# Altium project TestPCB_v1.0.PrjPcb
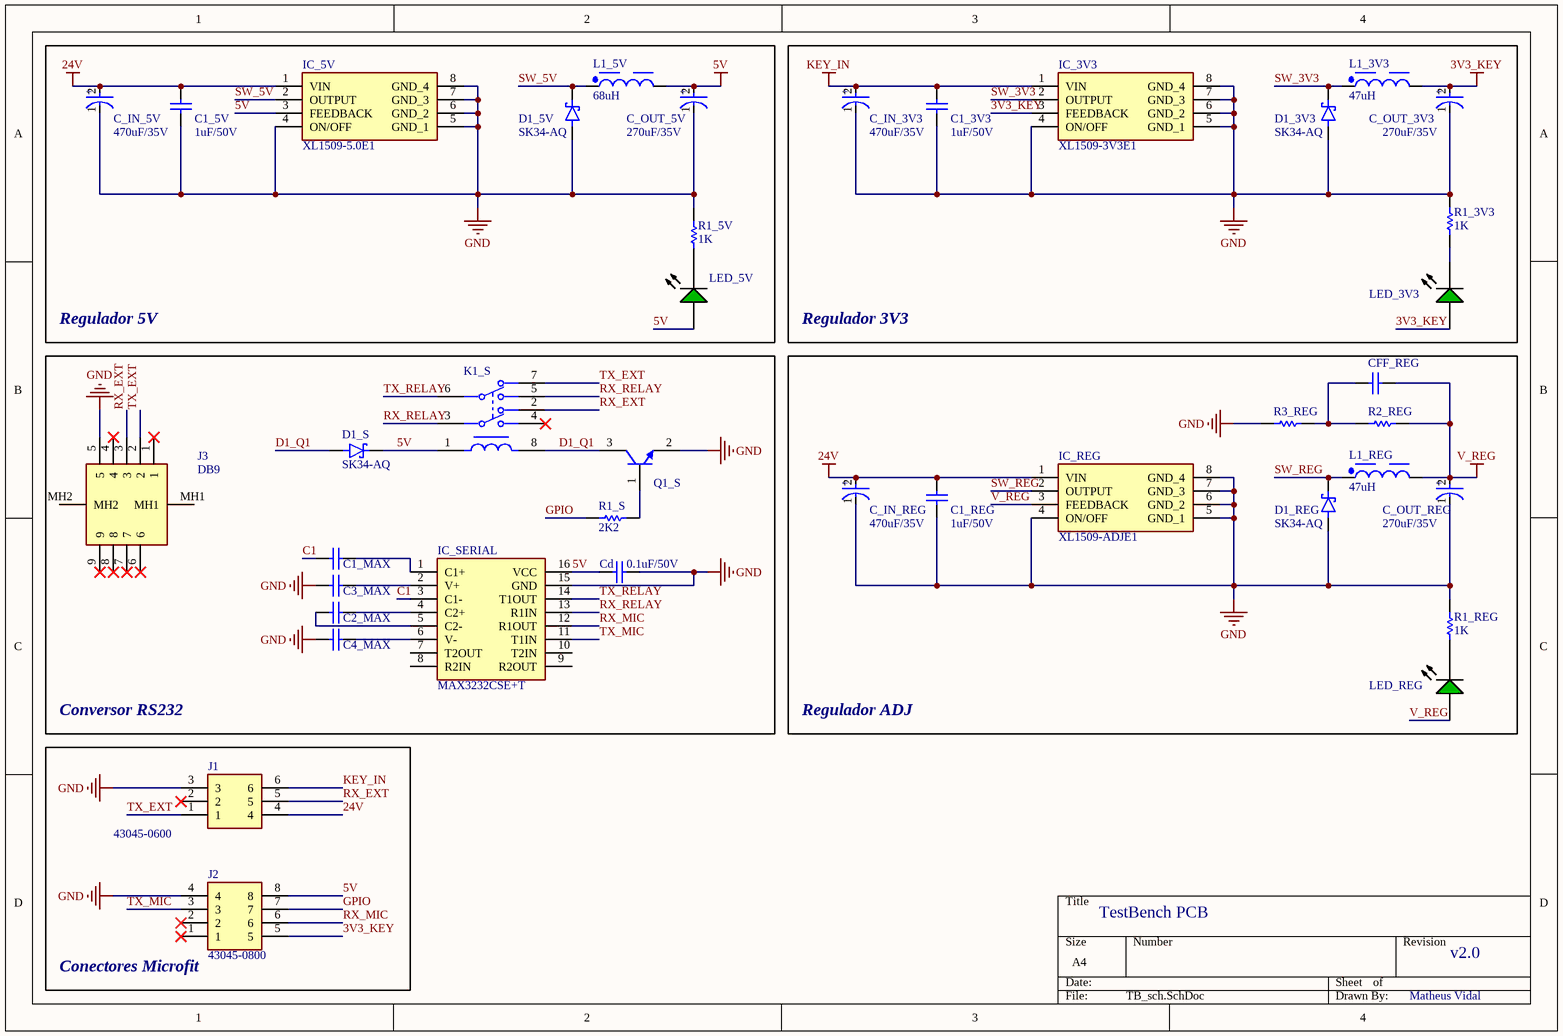
[diagram p0: TB_sch.SchDoc]
1 sheet, 40 parts. Net scope: global (net labels, ports and power ports of the same name join across sheets).
Board file: TB_brd.PcbDoc

## Sheet TB_sch.SchDoc
size A4; SheetNumber: 1; SheetTotal: 1

### Parts
C1_3V3  1uF/50V  [CAPC2013X135X45LL10T25]
C1_5V  1uF/50V  [CAPC2013X135X45LL10T25]
C1_MAX  0.1uF/50V  [CAPC2013X135X45LL10T25]  (value not drawn)
C1_REG  1uF/50V  [CAPC2013X135X45LL10T25]
C2_MAX  0.1uF/50V  [CAPC2013X135X45LL10T25]  (value not drawn)
C3_MAX  0.1uF/50V  [CAPC2013X135X45LL10T25]  (value not drawn)
C4_MAX  0.1uF/50V  [CAPC2013X135X45LL10T25]  (value not drawn)
C_IN_3V3  470uF/35V  [FP-UCW1H221MNL1GS-MFG]
C_IN_5V  470uF/35V  [FP-UCW1H221MNL1GS-MFG]
C_IN_REG  470uF/35V  [FP-UCW1H221MNL1GS-MFG]
C_OUT_3V3  270uF/35V  [FP-UCW1H221MNL1GS-MFG]
C_OUT_5V  270uF/35V  [FP-UCW1H221MNL1GS-MFG]
C_OUT_REG  270uF/35V  [FP-UCW1H221MNL1GS-MFG]
Cd  0.1uF/50V  [CAPC2013X135X45LL10T25]
CFF_REG  3.3nF/50V  [CAPC2013X135X45LL10T25]  (value not drawn)
D1_3V3  SK34-AQ  [DIOM7958X250N]
D1_5V  SK34-AQ  [DIOM7958X250N]
D1_REG  SK34-AQ  [DIOM7958X250N]
D1_S  SK34-AQ  [DIOM7958X250N]
IC_3V3  XL1509-3V3E1  [SOIC127P600X175-8N]
IC_5V  XL1509-5.0E1  [SOIC127P600X175-8N]
IC_REG  XL1509-ADJE1  [SOIC127P600X175-8N]
IC_SERIAL  MAX3232CSE+T  [SOIC127P600X175-16N]
J1  43045-0600  [43045-06(00,01,02,10)]
J2  43045-0800  [43045-08(00,01,02,10)]
J3  DB9  [L77DFE09S1AMN]
K1_S  G6K-2F-Y-TR-DC5  [FP-G6K-2F-Y-TR-DC5-MFG]  (value not drawn)
L1_3V3  47uH  [WE-PD_1280]
L1_5V  68uH  [WE-PD_1280]
L1_REG  47uH  [WE-PD_1280]
LED_3V3  (no value)  [AVAG-HSMX-C170_V]
LED_5V  (no value)  [AVAG-HSMX-C170_V]
LED_REG  (no value)  [AVAG-HSMX-C170_V]
Q1_S  MMBT2222LT1G  [ONSC-SOT-23-3-318-08_V]  (value not drawn)
R1_3V3  1K  [RESC2013X50X30LL20T20]
R1_5V  1K  [RESC2013X50X30LL20T20]
R1_REG  1K  [RESC2013X50X30LL20T20]
R1_S  2K2  [RESC2013X50X30LL20T20]
R2_REG  CRCW08050000Z0EA  [RESC2013X50X30LL20T20]  (value not drawn)
R3_REG  CRCW08050000Z0EA  [RESC2013X50X30LL20T20]  (value not drawn)

### Blocks framed on the sheet
Regulador 5V: C1_5V C_IN_5V C_OUT_5V D1_5V IC_5V L1_5V LED_5V R1_5V
Regulador 3V3: C1_3V3 C_IN_3V3 C_OUT_3V3 D1_3V3 IC_3V3 L1_3V3 LED_3V3 R1_3V3
Conversor RS232: C1_MAX C2_MAX C3_MAX C4_MAX Cd D1_S IC_SERIAL J3 K1_S Q1_S R1_S
Regulador ADJ: C1_REG C_IN_REG C_OUT_REG CFF_REG D1_REG IC_REG L1_REG LED_REG R1_REG R2_REG R3_REG
Conectores Microfit: J1 J2

### Nets
3V3_KEY: C_OUT_3V3.2(A) IC_3V3.3(FEEDBACK) J2.5 L1_3V3.2 LED_3V3.1(A)
5V: C_OUT_5V.2(A) Cd.2 D1_S.C(K) IC_5V.3(FEEDBACK) IC_SERIAL.16(VCC) J2.8 K1_S.1 L1_5V.2 LED_5V.1(A)
24V: C1_5V.2 C1_REG.2 C_IN_5V.2(A) C_IN_REG.2(A) IC_5V.1(VIN) IC_REG.1(VIN) J1.4
GND: C1_3V3.1 C1_5V.1 C1_REG.1 C3_MAX.2 C4_MAX.2 C_IN_3V3.1(C) C_IN_5V.1(C) C_IN_REG.1(C) C_OUT_3V3.1(C) C_OUT_5V.1(C) C_OUT_REG.1(C) Cd.1 D1_3V3.A D1_5V.A D1_REG.A IC_3V3.4(ON/OFF) IC_3V3.5(GND_1) IC_3V3.6(GND_2) IC_3V3.7(GND_3) IC_3V3.8(GND_4) IC_5V.4(ON/OFF) IC_5V.5(GND_1) IC_5V.6(GND_2) IC_5V.7(GND_3) IC_5V.8(GND_4) IC_REG.4(ON/OFF) IC_REG.5(GND_1) IC_REG.6(GND_2) IC_REG.7(GND_3) IC_REG.8(GND_4) IC_SERIAL.15(GND) J1.3 J2.4 J3.5 Q1_S.2(E) R1_3V3.2 R1_5V.2 R1_REG.2 R3_REG.1
KEY_IN: C1_3V3.2 C_IN_3V3.2(A) IC_3V3.1(VIN) J1.6
V_REG: C_OUT_REG.2(A) CFF_REG.1 IC_REG.3(FEEDBACK) L1_REG.2 LED_REG.1(A) R2_REG.2
C1: C1_MAX.2 IC_SERIAL.3(C1-)
D1_Q1: D1_S.A K1_S.8 Q1_S.3(C)
GPIO: J2.7 R1_S.2
RX_EXT: J1.5 J3.3 K1_S.2
RX_MIC: IC_SERIAL.12(R1OUT) J2.6
RX_RELAY: IC_SERIAL.13(R1IN) K1_S.3 K1_S.5
SW_3V3: D1_3V3.C(K) IC_3V3.2(OUTPUT) L1_3V3.1
SW_5V: D1_5V.C(K) IC_5V.2(OUTPUT) L1_5V.1
SW_REG: D1_REG.C(K) IC_REG.2(OUTPUT) L1_REG.1
TX_EXT: J1.1 J3.2 K1_S.7
TX_MIC: IC_SERIAL.11(T1IN) J2.3
TX_RELAY: IC_SERIAL.14(T1OUT) K1_S.6
NetC1_MAX_1: C1_MAX.1 IC_SERIAL.1(C1+)
NetC2_MAX_1: C2_MAX.1 IC_SERIAL.4(C2+)
NetC2_MAX_2: C2_MAX.2 IC_SERIAL.5(C2-)
NetC3_MAX_1: C3_MAX.1 IC_SERIAL.2(V+)
NetC4_MAX_1: C4_MAX.1 IC_SERIAL.6(V-)
NetCFF_REG_2: CFF_REG.2 R2_REG.1 R3_REG.2
NetLED_3V3_2: LED_3V3.2(K) R1_3V3.1
NetLED_5V_2: LED_5V.2(K) R1_5V.1
NetLED_REG_2: LED_REG.2(K) R1_REG.1
NetQ1_S_1: Q1_S.1(B) R1_S.1

Not connected (* = marked no-connect by the designer): IC_SERIAL 7(T2OUT) 8(R2IN) 9(R2OUT) 10(T2IN); J1 2*; J2 1* 2*; J3 1* 4* 6* 7* 8* 9* MH1 MH2; K1_S 4*

### Notes on the sheet
- TestBench PCB
- v2.0
- Matheus Vidal
- (in symbol CMP-12462-000041-1) +

### Library data of the parts
C1_3V3 C1_5V C1_MAX C1_REG C2_MAX C3_MAX C4_MAX Cd CFF_REG = CMP-1662-00015-2: Chip Capacitor, 4.7 uF, +/- 10%, 16 V, -55 to 85 degC, 0805 (2012 Metric), RoHS, Tape and Reel; PartNumber: GRM21BR61C475KA88L; Voltage Rating (DC): 16 V; Capacitance: 4.7 uF; Type (Capacitors): X5R; Case\/Package: 0805; Pins: 2; DatasheetVersion: 03/2016; REACH SVHC: No SVHC; Tolerance: 10%; Width: 1.25 mm; Mount: Surface Mount; ComponentLink1Description: Manufacturer URL; Case Code (Metric): 2012; PackageDescription: 2-Pin Surface Mount Device, Body 2 x 1.25 mm; Height: 1.25 mm; Voltage Rating: 16 V; Max Operating Temperature: 85 degC; RoHSCompliant: true; Length: 2 mm; ComponentLink1URL: http://www.murata.com/; Mounting Technology: Surface Mount; Packaging: Tape and Reel; Min Operating Temperature: -55 degC; ComponentLink2Description: Datasheet; Case Code (Imperial): 0805; Radiation Hardening: No; Package Quantity: 3000; PackageReference: 0805; ComponentLink2URL: http://search.murata.co.jp/Ceramy/image/img/A01X/G101/ENG/GRM21BR61C475KA88-01.pdf
C_IN_3V3 C_IN_5V C_IN_REG C_OUT_3V3 C_OUT_5V C_OUT_REG = CMP-12462-000041-1: CAP ALUM 220UF 20% 50V SMD; Dissipation Factor: 0.14%; Ripple Current: 670mA; Dielectric Material: Aluminium; Life (Hours): 7000Hour; Impedance: 350mR; Leakage Current: 3uA; Capacitance: 220uF; Max Operating Temperature: 105°C; Features: General Purpose; Voltage Rating: 50V; Case/Package: Radial; Termination: SMD/SMT; Tolerance: 20%; Package Quantity: 500; Construction: Cylindrical; REACH SVHC: No SVHC; Width: 10.3mm; Min Operating Temperature: -25°C; RoHS Compliant: Yes; Mount: Surface Mount; Diameter: 10mm; Voltage: 50V; Series: CW; Voltage Rating (DC): 50V; Ripple Current (AC): 670mA; Radiation Hardening: No; Length: 10mm; Packaging: Tape and Reel; Height: 10mm; Height - Seated (Max): 0.394inch
D1_3V3 D1_5V D1_REG D1_S = SK34-AQ: MF: Diotec Semiconductor; Package: None; Price: None; Value: *; MP: SK34-AQ; Availability: Unavailable
IC_3V3 IC_5V IC_REG = XL1509-5.0E1: Integrated Circuit; Manufacturer_Name: XLSEMI; Datasheet Link: https://datasheet.lcsc.com/szlcsc/XLSEMI-XL1509-5-0E1_C61063.pdf; Height: 1.75mm; Manufacturer_Part_Number: XL1509-5.0E1
IC_SERIAL = MAX3232CSE+T: Integrated Circuit; Manufacturer_Name: Analog Devices; Datasheet Link: https://datasheets.maximintegrated.com/en/ds/MAX3222-MAX3241.pdf; Height: 1.75mm; Manufacturer_Part_Number: MAX3232CSE+T; Mouser Part Number: 700-MAX3232CSET; Mouser Price/Stock: https://www.mouser.co.uk/ProductDetail/Analog-Devices-Maxim-Integrated/MAX3232CSE%2bT?qs=CDqwynd4ZNoTB%252BLjbeQ4Qg%3D%3D; Arrow Part Number: MAX3232CSE+T; Arrow Price/Stock: https://www.arrow.com/en/products/max3232cset/analog-devices?utm_currency=USD&region=nac
J1 = 43045-0600: Connector; Manufacturer_Name: Molex; Datasheet Link: https://www.molex.com/pdm_docs/sd/430450200_sd.pdf; Height: 9.9mm; Manufacturer_Part_Number: 43045-0600; Mouser Part Number: 538-43045-0600; Mouser Price/Stock: https://www.mouser.co.uk/ProductDetail/Molex/43045-0600?qs=mrPiglD9aYJ8CzJ%2FE2PNbw%3D%3D; Arrow Part Number: 43045-0600; Arrow Price/Stock: https://www.arrow.com/en/products/43045-0600/molex?region=nac
J2 = 43045-0800: Connector; Manufacturer_Name: Molex; Datasheet Link: https://www.molex.com/pdm_docs/sd/430450200_sd.pdf; Height: 8.77mm; Manufacturer_Part_Number: 43045-0800; Mouser Part Number: 538-43045-0800; Mouser Price/Stock: https://www.mouser.co.uk/ProductDetail/Molex/43045-0800?qs=MGlPTwjtJ4Z70Z3DbkGxKw%3D%3D
J3 = L77DFE09S1AMN: Connector; Manufacturer_Name: Amphenol Communications Solutions; Datasheet Link: https://cdn.amphenol-icc.com/media/wysiwyg/files/drawing/l77dfxxxs1amn.pdf; Height: 12.7mm; Manufacturer_Part_Number: L77DFE09S1AMN; Mouser Part Number: 523-L77DFE09S1AMN; Mouser Price/Stock: https://www.mouser.co.uk/ProductDetail/Amphenol-Commercial-Products/L77DFE09S1AMN?qs=mq7kV%2Fq8lk7eGEI8ax9brw%3D%3D
K1_S = CMP-08823-000003-1: RELAY TELECOM DPDT 1A 5VDC; Manufacturer: Omron; Coil Current: 21.1mA; Coil Type: Non-Latching; Number Of Contacts: 2; Coil Voltage: 5V; Coil Power: 100mW; Standoff Height: 0.3mm; Coil Resistance: 237Ω; Current Rating: 2A; Digikey Description: RELAY TELECOM DPDT 1A 5VDC; Manufacturer Part Number: G6K-2F-Y-TR-DC5; Height: 5.4mm; Temperature Range Low: -40°C; Throw Configuration: DPDT; Package: G6K-2F-Y-TR-DC5; Device Class L1: Electromechanical; Device Class L2: Relays; Mouser Description: Electromechanical Relay DPDT 1A 5VDC 237Ohm Surface Mount; ComponentLink2URL: https://omronfs.omron.com/en_US/ecb/products/pdf/en-g6k.pdf; Lead Free: Yes; Device Class L3: Signal Relays; Temperature: -40°C to +70°C; Category: Relay; RoHS: TRUE; Ambient Temperature Range Low: -40°C; Temperature Range High: +70°C; Octopart: https://octopart.com/g6k-2f-y-tr-dc5-omron-697853; Ambient Temperature Range High: +70°C; Automotive: No; ComponentLink2Description: Datasheet; Switching Current: 1A
L1_3V3 L1_5V L1_REG = CMP-0227-00190-2: NexarPartId: 8917154; Test Frequency: 1kHz; Saturation Current: 900mA; Shielding: Shielded; Core Material: Ferrite; Series Resistance: 980mΩ; Tolerance: 20%; Current Rating: 980mA; Inductance: 470µH; Self Resonant Frequency: 2.6MHz; DC Resistance (DCR): 450mΩ; Height: 8mm; Composition: Wirewound; Depth: 12mm; Width: 12mm; Termination: SMD/SMT; Ambient Temperature Range High: 85°C; Resistance: 980mΩ; Min Operating Temperature: -40°C; RoHS: Compliant; Length: 12mm; Mount: Surface Mount; Inductance Tolerance: 20%; Case/Package: Nonstandard; Ambient Temperature Range Low: -40°C; Max Operating Temperature: 125°C; Number of Pins: 2; Max DC Current: 900mA; RMS Current (Irms): 900mA; Height - Seated (Max): 8.001mm; Packaging: Tape & Reel (TR); Lead Pitch: 7mm; Weight: 4.535924g; REACH SVHC: Unknown
LED_3V3 LED_5V LED_REG = CMP-2000-05062-1: Chip LED, Green, 2.2 V, -40 to 85 degC, 2-Pin SMD, Pb-Free, Tape and Reel; Manufacturer: Avago; No. of Pins: 2; Peak Wavelength: 570nm; SVHC: NoSVHC(16-Jun-2014); Dominant Wavelength: 572nm; Forward Current If: 20mA; Viewing Angle: 170deg; Lens Shape: Rectangular; PIV Max: 5V; External Width: 1.25mm; LED Type: Standard; External Depth: 0.8mm; Opto Mounting Orientation: Top; Luminous Intensity: 15mcd; Luminous Intensity Min: 4mcd; Forward Voltage VF Max: 2.6V; External Length / Height: 2mm; Bulb Size: 1.25mmx1.4mm; Light Area Height: 1mm; Voltage Vf Typ: 2.2V; Operating Temperature Max: 85degC; Datasheet Version: Oct-08; MSL: MSL2A-4weeks; Peak Forward Current: 20mA; Package Description: 2-Pin Surface Mount Device, Body 2 x 1.25 mm, Height 0.8 mm; Datasheet URL: https://datasheet.ciiva.com/29280/180495-da-01-en-chip-led-hsmg-c170-gelb-gruen-29280971.pdf; Storage Temperature Min: -40degC; LED Colour: Green; Wavelength Typ: 570nm; Mounting Type: SMD; Forward Current If Max: 20mA; Dominant Wavelength Typ: 572nm; LED Mounting: SMD; Operating Temperature Range: -30degCto+85degC; Operating Temperature Min: -30degC; Manufacturer URL: http://www.avagotech.com/; Packaging: CutTape; Luminous Intensity Typ: 15mcd; Package Reference: HSMX-C170; Storage Temperature Max: 85degC; Opto Case Style: SMD; Forward Voltage: 2.2V
Q1_S = CMP-0722-00001-2: General Purpose Transistor, NPN Silicon, 3-Pin SOT-23, Pb-Free, Tape and Reel; Manufacturer: On Semiconductor; IC Continuous (A): 0.6; fT Min (MHz): 250; DatasheetVersion: Rev. 10; ComponentLink3Description: Package Specification; PackageVersion: Rev. AP, 11/2009; ComponentLink3URL: http://www.onsemi.cn/pub_link/Collateral/318-08.PDF; ComponentLink1URL: http://www.onsemi.com/; ComponentLink2URL: http://www.onsemi.cn/pub_link/Collateral/MMBT2222LT1-D.PDF; ComponentLink2Description: Datasheet; RoHS: TRUE; Mounting Technology: Surface Mount; PartNumber: MMBT2222LT1G; ComponentLink1Description: Manufacturer URL; PackageDescription: 3-Pin Small Outline Transistor, Body 2.92 x 1.3 mm, Pitch 0.95 mm; Packing: Tape and Reel; Polarity: NPN; PackageReference: SOT-23-3-318-08
R1_3V3 R1_5V R1_REG R1_S = CMP-2001-04896-1: Manufacturer: Vishay Dale; Part Number: CRCW08050000Z0EA
R2_REG R3_REG = CMP-2001-04896-1: Manufacturer: Vishay Dale; Part Number: CRCW08050000Z0EA